# EAGLE design EiBotBoard-v23 (EAGLE 7.2.0)
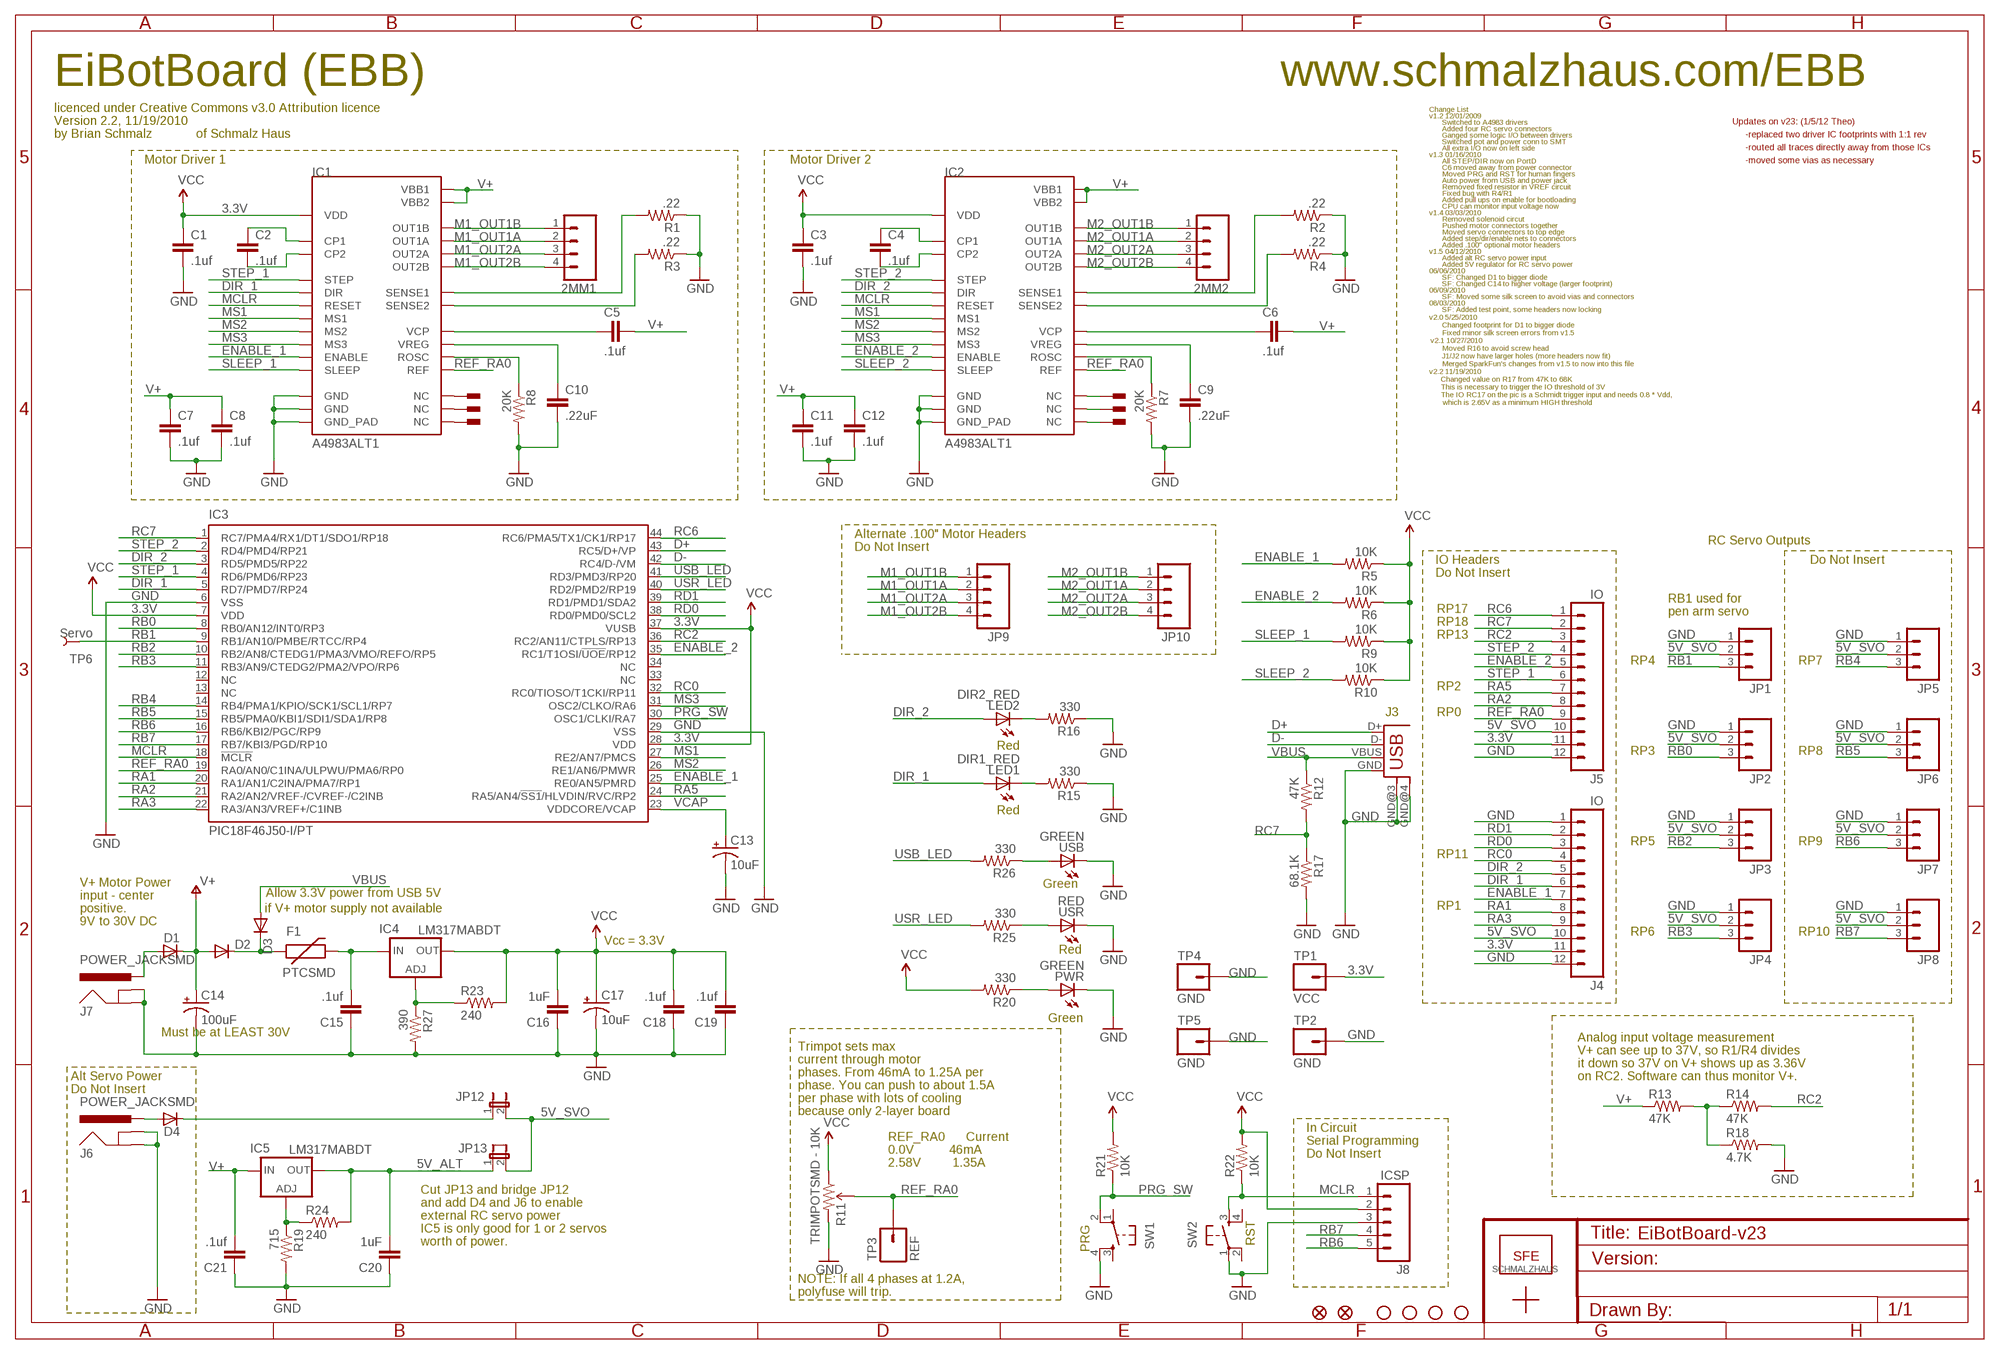
[diagram p0: schematic, sheet 1]

## Parts
2MM1  SCHMALZHAUS_M04  [SCHMALZHAUS_SCREWTERMINAL-3.5MM-4_LOCK]
2MM2  SCHMALZHAUS_M04  [SCHMALZHAUS_SCREWTERMINAL-3.5MM-4_LOCK]
C1  .1uf  CAP0603  [0603]
C2  .1uf  CAP0603  [0603]
C3  .1uf  CAP0603  [0603]
C4  .1uf  CAP0603  [0603]
C5  .1uf  CAP0603  [0603]
C6  .1uf  CAP0603  [0603]
C7  .1uf  CAP0603  [0603]
C8  .1uf  CAP0603  [0603]
C9  .22uF  CAP0603  [0603]
C10  .22uF  CAP0603  [0603]
C11  .1uf  CAP0603  [0603]
C12  .1uf  CAP0603  [0603]
C13  10uF  CAP_POL1206  [EIA3216]
C14  100uF  CAP_POLG  [PANASONIC_G]
C15  .1uf  CAP0603  [0603]
C16  1uF  CAP0603  [0603]
C17  10uF  CAP_POL1206  [EIA3216]
C18  .1uf  CAP0603  [0603]
C19  .1uf  CAP0603  [0603]
C20  1uF  CAP0603  [0603]
C21  .1uf  CAP0603  [0603]
D1  DIODE-DO214AC  [DO214AC]
D2  DIODESMA  [SMA-DIODE]
D3  DIODESMA  [SMA-DIODE]
D4  CGRM4001-G  [SOD-123_MINI-SMA]
F1  PTCSMD  [PTC-1206]
IC1  A4983ALT1  [QFN-28-5MM_ALT1]
IC2  A4983ALT1  [QFN-28-5MM_ALT1]
IC3  PIC18F46J50-I/PT  PIC18F4J50  [TQFP44]
IC4  LM317MABDT  [DPACK]
IC5  LM317MABDT  [DPACK]
J3  USBSMD  [USB-MINIB]
J4  IO  M12PTH  [1X12]
J5  IO  M12PTH  [1X12]
J6  POWER_JACKSMD  [POWER_JACK_SMD]
J7  POWER_JACKSMD  [POWER_JACK_SMD]
J8  ICSP  M05_WIDENOSILK  [1X05_NOSILK]
JP1  M03LOCK_NO_SILK  [1X03_LOCK_NO_SILK]
JP2  M031X03_NO_SILK  [1X03_NO_SILK]
JP3  M031X03_NO_SILK  [1X03_NO_SILK]
JP4  M031X03_NO_SILK  [1X03_NO_SILK]
JP5  M031X03_NO_SILK  [1X03_NO_SILK]
JP6  M031X03_NO_SILK  [1X03_NO_SILK]
JP7  M031X03_NO_SILK  [1X03_NO_SILK]
JP8  M031X03_NO_SILK  [1X03_NO_SILK]
JP9  M04POLAR  [MOLEX-1X4]
JP10  M04POLAR  [MOLEX-1X4]
JP11  LOGO-SFENEW  [SFE-NEW-WEBLOGO]
JP12  JUMPER-2SMD-NO  [SJ_2S-NO]
JP13  JUMPER-2SMD-NO  [SJ_2S-NO]
JP14  FIDUCIALUFIDUCIAL  [MICRO-FIDUCIAL]
JP15  FIDUCIALUFIDUCIAL  [MICRO-FIDUCIAL]
LED1  DIR1_RED  LED0603  [LED-0603]
LED2  DIR2_RED  LED0603  [LED-0603]
PWR  GREEN  LED0603  [LED-0603]
R1  .22  R-US_R0805  [R0805]
R2  .22  R-US_R0805  [R0805]
R3  .22  R-US_R0805  [R0805]
R4  .22  R-US_R0805  [R0805]
R5  10K  R-US_R0603  [R0603]
R6  10K  R-US_R0603  [R0603]
R7  20K  R-US_R0603  [R0603]
R8  20K  R-US_R0603  [R0603]
R9  10K  R-US_R0603  [R0603]
R10  10K  R-US_R0603  [R0603]
R11  TRIMPOTSMD - 10K  TRIMPOTSMD  [TRIMPOT-3MM]
R12  47K  R-US_R0603  [R0603]
R13  47K  R-US_R0603  [R0603]
R14  47K  R-US_R0603  [R0603]
R15  330  R-US_R0603  [R0603]
R16  330  R-US_R0603  [R0603]
R17  68.1K  R-US_R0603  [R0603]
R18  4.7K  R-US_R0603  [R0603]
R19  715  R-US_R0603  [R0603]
R20  330  R-US_R0603  [R0603]
R21  10K  R-US_R0603  [R0603]
R22  10K  R-US_R0603  [R0603]
R23  240  R-US_R0603  [R0603]
R24  240  R-US_R0603  [R0603]
R25  330  R-US_R0603  [R0603]
R26  330  R-US_R0603  [R0603]
R27  390  R-US_R0603  [R0603]
SW1  PRG  TAC_SWITCHSND  [TACTILE_SWITCH_SMD]
SW2  RST  TAC_SWITCHSND  [TACTILE_SWITCH_SMD]
TP1  VCC  M01_WIDENOSLIK  [1X01_NOSILK]
TP2  GND  M01_WIDENOSLIK  [1X01_NOSILK]
TP3  REF  M01PTH  [1X01]
TP4  GND  M01_WIDENOSLIK  [1X01_NOSILK]
TP5  GND  M01_WIDENOSLIK  [1X01_NOSILK]
TP6  Servo  TEST-POINT3X5  [PAD.03X.05]
U$1  SCHMALZHAUSSCHMALZHAUS_SMALL  [SCHMALZHAUS_SMALL]
U$2  STAND-OFF  [STAND-OFF]
U$3  STAND-OFF  [STAND-OFF]
U$4  STAND-OFF  [STAND-OFF]
U$5  STAND-OFF  [STAND-OFF]
U$6  PAD  [PAD-0.008]
U$7  PAD  [PAD-0.008]
U$8  PAD  [PAD-0.008]
U$9  PAD  [PAD-0.008]
U$10  PAD  [PAD-0.008]
U$11  PAD  [PAD-0.008]
USB  GREEN  LED0603  [LED-0603]
USR  RED  LED0603  [LED-0603]

## Nets
3.3V: C1.1 C3.1 C16.2 C17.A(+) C18.2 C19.2 IC1.P$15(VDD) IC2.P$15(VDD) IC3.7(VDD) IC3.28(VDD) IC3.37(VUSB) IC4.4(OUT) J4.11 J5.11 J8.2 R5.1 R6.1 R9.1 R10.1 R11.1(CCW) R20.2 R21.2 R22.2 R23.2 TP1.1 ; supply symbol labelled VCC
5V_ALT: C20.2 IC5.4(OUT) JP13.1 R24.2
5V_SVO: J4.10 J5.10 JP1.2 JP2.2 JP3.2 JP4.2 JP5.2 JP6.2 JP7.2 JP8.2 JP12.2 JP13.2
D+: IC3.43(RC5/D+/VP) J3.D+
D-: IC3.42(RC4/D-/VM) J3.D-
DIR_1: IC1.P$19(DIR) IC3.5(RD7/PMD7/RP24) J4.6 LED1.A
DIR_2: IC2.P$19(DIR) IC3.3(RD5/PMD5/RP22) J4.5 LED2.A
ENABLE_1: IC1.P$2(ENABLE) IC3.25(RE0/AN5/PMRD) J4.7 R5.2
ENABLE_2: IC2.P$2(ENABLE) IC3.35(RC1/T1OSI/!UOE!/RP12) J5.5 R6.2
GND: C1.2 C3.2 C7.2 C8.2 C9.2 C10.2 C11.2 C12.2 C13.C(-) C14.- C15.1 C16.1 C17.C(-) C18.1 C19.1 C20.1 C21.1 IC1.P$3(GND) IC1.P$18(GND) IC1.P$29(GND_PAD) IC2.P$3(GND) IC2.P$18(GND) IC2.P$29(GND_PAD) IC3.6(VSS) IC3.29(VSS) J3.GND J3.GND@3(GND) J3.GND@4(GND) J4.1 J4.12 J5.12 J6.GND(GNDBREAK) J6.P$4(GND) J7.GND(GNDBREAK) J7.P$4(GND) J8.3 JP1.1 JP2.1 JP3.1 JP4.1 JP5.1 JP6.1 JP7.1 JP8.1 PWR.C R1.1 R2.1 R3.1 R4.1 R7.2 R8.2 R11.3(CW) R15.1 R16.1 R17.2 R18.2 R19.2 R27.2 SW1.4 SW2.1 TP2.1 TP4.1 TP5.1 USB.C USR.C
M1_OUT1A: 2MM1.2 IC1.P$24(OUT1A) JP9.2
M1_OUT1B: 2MM1.1 IC1.P$21(OUT1B) JP9.1
M1_OUT2A: 2MM1.3 IC1.P$26(OUT2A) JP9.3
M1_OUT2B: 2MM1.4 IC1.P$1(OUT2B) JP9.4
M2_OUT1A: 2MM2.2 IC2.P$24(OUT1A) JP10.2
M2_OUT1B: 2MM2.1 IC2.P$21(OUT1B) JP10.1
M2_OUT2A: 2MM2.3 IC2.P$26(OUT2A) JP10.3
M2_OUT2B: 2MM2.4 IC2.P$1(OUT2B) JP10.4
MCLR: IC1.P$12(RESET) IC2.P$12(RESET) IC3.18(!MCLR!) J8.1 R22.1 SW2.3
MS1: IC1.P$9(MS1) IC2.P$9(MS1) IC3.27(RE2/AN7/PMCS)
MS2: IC1.P$10(MS2) IC2.P$10(MS2) IC3.26(RE1/AN6/PMWR)
MS3: IC1.P$11(MS3) IC2.P$11(MS3) IC3.31(OSC2/CLKO/RA6)
N$2: D2.C D3.C F1.1
N$3: C2.1 IC1.P$4(CP1)
N$4: R13.2 R14.1 R18.1
N$5: C2.2 IC1.P$5(CP2)
N$6: D1.A J7.VIN0(PWR)
N$7: D4.A J6.VIN0(PWR)
N$8: IC5.1(ADJ) R19.1 R24.1
N$9: IC4.1(ADJ) R23.1 R27.1
N$10: D4.C JP12.1
N$11: IC1.P$7(NC) U$9.P$1
N$12: IC1.P$20(NC) U$11.P$1
N$13: IC1.P$25(NC) U$10.P$1
N$14: IC2.P$7(NC) U$6.P$1
N$15: IC2.P$20(NC) U$7.P$1
N$16: C4.1 IC2.P$4(CP1)
N$17: C4.2 IC2.P$5(CP2)
N$18: IC2.P$25(NC) U$8.P$1
N$19: IC1.P$13(ROSC) R8.1
N$20: C10.1 IC1.P$8(VREG)
N$21: C5.1 IC1.P$6(VCP)
N$26: LED2.C R16.2
N$27: PWR.A R20.1
N$29: R26.1 USB.A
N$30: R25.1 USR.A
N$31: IC1.P$27(SENSE2) R3.2
N$32: IC1.P$23(SENSE1) R1.2
N$35: LED1.C R15.2
N$36: C15.2 F1.2 IC4.3(IN)
N$41: C6.1 IC2.P$6(VCP)
N$43: IC2.P$23(SENSE1) R2.2
N$44: IC2.P$27(SENSE2) R4.2
N$45: C9.1 IC2.P$8(VREG)
N$48: IC2.P$13(ROSC) R7.1
PRG_SW: IC3.30(OSC1/CLKI/RA7) R21.1 SW1.2
RA1: IC3.20(RA1/AN1/C2INA/PMA7/RP1) J4.8
RA2: IC3.21(RA2/AN2/VREF-/CVREF-/C2INB) J5.8
RA3: IC3.22(RA3/AN3/VREF+/C1INB) J4.9
RA5: IC3.24(RA5/AN4/!SS1!/HLVDIN/RVC/RP2) J5.7
RB0: IC3.8(RB0/AN12/INT0/RP3) JP2.3
RB1: IC3.9(RB1/AN10/PMBE/RTCC/RP4) JP1.3 TP6.P$1
RB2: IC3.10(RB2/AN8/CTEDG1/PMA3/VMO/REFO/RP5) JP3.3
RB3: IC3.11(RB3/AN9/CTEDG2/PMA2/VPO/RP6) JP4.3
RB4: IC3.14(RB4/PMA1/KPIO/SCK1/SCL1/RP7) JP5.3
RB5: IC3.15(RB5/PMA0/KBI1/SDI1/SDA1/RP8) JP6.3
RB6: IC3.16(RB6/KBI2/PGC/RP9) J8.5 JP7.3
RB7: IC3.17(RB7/KBI3/PGD/RP10) J8.4 JP8.3
RC0: IC3.32(RC0/TIOSO/T1CKI/RP11) J4.4
RC2: IC3.36(RC2/AN11/CTPLS/RP13) J5.3 R14.2
RC6: IC3.44(RC6/PMA5/TX1/CK1/RP17) J5.1
RC7: IC3.1(RC7/PMA4/RX1/DT1/SDO1/RP18) J5.2 R12.2 R17.1
RD0: IC3.38(RD0/PMD0/SCL2) J4.3
RD1: IC3.39(RD1/PMD1/SDA2) J4.2
REF_RA0: IC1.P$17(REF) IC2.P$17(REF) IC3.19(RA0/AN0/C1INA/ULPWU/PMA6/RP0) J5.9 R11.2(WIPER) TP3.1
SLEEP_1: IC1.P$14(SLEEP) R9.2
SLEEP_2: IC2.P$14(SLEEP) R10.2
STEP_1: IC1.P$16(STEP) IC3.4(RD6/PMD6/RP23) J5.6
STEP_2: IC2.P$16(STEP) IC3.2(RD4/PMD4/RP21) J5.4
USB_LED: IC3.41(RD3/PMD3/RP20) R26.2
USR_LED: IC3.40(RD2/PMD2/RP19) R25.2
V+: C5.2 C6.2 C7.1 C8.1 C11.1 C12.1 C14.+ C21.2 D1.C D2.A IC1.P$22(VBB1) IC1.P$28(VBB2) IC2.P$22(VBB1) IC2.P$28(VBB2) IC5.3(IN) R13.1
VBUS: D3.A J3.VBUS R12.1
VCAP: C13.A(+) IC3.23(VDDCORE/VCAP)
Unconnected: IC3.12(NC) IC3.13(NC) IC3.33(NC) IC3.34(NC) SW1.1 SW1.3 SW2.2 SW2.4

## Notes on the sheet
- EiBotBoard (EBB) | www.schmalzhaus.com/EBB
- licenced under Creative Commons v3.0 Attribution licence | Change List
- v1.2 12/01/2009
- Version 2.2, 11/19/2010 | Switched to A4983 drivers | Updates on v23: (1/5/12 Theo)
- Added four RC servo connectors
- by Brian Schmalz | of Schmalz Haus | Ganged some logic I/O between drivers | -replaced two driver IC footprints with 1:1 rev
- Switched pot and power conn to SMT
- All extra I/O now on left side | -routed all traces directly away from those ICs
- v1.3 01/16/2010
- Motor Driver 1 | Motor Driver 2 | All STEP/DIR now on PortD | -moved some vias as necessary
- C6 moved away from power connector
- Moved PRG and RST for human fingers
- Auto power from USB and power jack
- Removed fixed resistor in VREF circuit
- Fixed bug with R4/R1
- Added pull ups on enable for bootloading
- CPU can monitor input voltage now
- v1.4 03/03/2010
- Removed solenoid circut
- Pushed motor connectors together
- Moved servo connectors to top edge
- Added step/dir/enable nets to connectors
- Added .100" optional motor headers
- v1.5 04/12/2010
- Added alt RC servo power input
- Added 5V regulator for RC servo power
- 06/06/2010
- SF: Changed D1 to bigger diode
- SF: Changed C14 to higher voltage (larger footprint)
- 06/09/2010
- SF: Moved some silk screen to avoid vias and connectors
- 08/03/2010
- SF: Added test point, some headers now locking
- v2.0 5/25/2010
- Changed footprint for D1 to bigger diode
- Fixed minor silk screen errors from v1.5
- v2.1 10/27/2010
- Moved R16 to avoid screw head
- J1/J2 now have larger holes (more headers now fit)
- Merged SparkFun's changes from v1.5 to now into this file
- v2.2 11/19/2010
- Changed value on R17 from 47K to 68K
- This is necessary to trigger the IO threshold of 3V
- The IO RC17 on the pic is a Schmidt trigger input and needs 0.8 * Vdd,
- which is 2.65V as a minimum HIGH threshold
- Alternate .100" Motor Headers
- RC Servo Outputs
- Do Not Insert
- IO Headers | Do Not Insert
- Do Not Insert
- RB1 used for
- RP17 | pen arm servo
- RP18
- RP13
- RP4 | RP7
- RP2
- J3 | RP0
- Red
- RP3 | RP8
- Red
- RP5 | RP9
- RP11
- V+ Motor Power | Green
- input - center | Allow 3.3V power from USB 5V
- positive. | if V+ motor supply not available | RP1
- 9V to 30V DC
- RP6 | RP10
- Vcc = 3.3V | Red
- Green
- Must be at LEAST 30V
- Analog input voltage measurement
- Trimpot sets max
- V+ can see up to 37V, so R1/R4 divides
- current through motor
- it down so 37V on V+ shows up as 3.36V
- phases. From 46mA to 1.25A per
- Alt Servo Power | on RC2. Software can thus monitor V+.
- phase. You can push to about 1.5A
- Do Not Insert
- per phase with lots of cooling
- because only 2-layer board
- In Circuit
- REF_RA0      Current
- Serial Programming
- 0.0V          46mA
- Do Not Insert
- 2.58V         1.35A
- Cut JP13 and bridge JP12
- and add D4 and J6 to enable
- external RC servo power
- PRG
- IC5 is only good for 1 or 2 servos
- worth of power. | RST
- NOTE: If all 4 phases at 1.2A,
- polyfuse will trip.

## Library data of the parts
2MM1 2MM2 = EiBotBoard-v21:SCHMALZHAUS_M04: Header 4 Standard 4-pin 0.1" header. Use with straight break away headers (SKU : PRT-00116), right angle break away headers (PRT-00553), swiss pins (PRT-00743), machine pins (PRT-00117), and female headers (PRT-00115). Molex polarized connector foot print use with SKU : PRT-08231 with associated crimp pins and housings.
C1-C12 C15 C16 C18-C21 = SparkFun-2-11-09:CAP: Capacitor Standard 0603 ceramic capacitor, and 0.1" leaded capacitor.
C13 C17 = SparkFun-2-11-09:CAP_POL: Capacitor Polarized These are standard SMD and PTH capacitors. Normally 10uF, 47uF, and 100uF in electrolytic and tantalum varieties. Always verify the external diameter of the through hole cap, it varies with capacity, voltage, and manufacturer. The EIA devices should be standard.
C14 = SparkFun:CAP_POL: Capacitor Polarized These are standard SMD and PTH capacitors. Normally 10uF, 47uF, and 100uF in electrolytic and tantalum varieties. Always verify the external diameter of the through hole cap, it varies with capacity, voltage, and manufacturer. The EIA devices should be standard.
D1 = diode:DIODE-: DIODE
D2 D3 = SparkFun:DIODE: Diode These are standard reverse protection diodes and small signal diodes. SMA package can handle up to about 1A. SOD-323 can handle about 200mA. What the SOD-323 package when ordering, there are some mfgs out there that are 5-pin packages.
D4 = diode:CGRM400*-G: Molded plasitc,JEDEC SOD-123/Mini SMA Source: Comchip CGRM4001-G.pdf
F1 = SchmalzHaus:PTC: Resettable Fuse PTC Resettable Fuse. Spark Fun Electronics SKU : COM-08357
IC1 IC2 = Testing:A4983: DMOS Microstepping Driver with Translator
IC3 = SchmalzHaus:PIC18F4*J50
IC4 IC5 = v-reg:LM317?*: 500 mA Adjustable Output Positive Voltage Regulator Source: http://www.onsemi.co.jp .. LM317M-D.PDF
J3 = SchmalzHaus:USB: USB Connectors USB-B-PTH is fully proven SKU : PRT-00139 USB-miniB is fully proven SKU : PRT-00587 USB-A-PCB is untested. USB-A-H is throughly reviewed, but untested. Spark Fun Electronics SKU : PRT-00437 USB-B-SMT is throughly reviewed, but untested. Needs silkscreen touching up. USB-A-S has not been used/tested USB-MB-H has not been used/tested
J4 J5 = SparkFun-12-01-09:M12: Header 12 Standard 12-pin 0.1" header. Use with straight break away headers (SKU : PRT-00116), right angle break away headers (PRT-00553), swiss pins (PRT-00743), machine pins (PRT-00117), and female headers (PRT-00115).
J6 J7 = SparkFun11_03_09:POWER_JACK: Power Jack This is the standard 5.5mm barrel jack for power. The PTH is the most common, proven, reliable, footprint. All others are experimental. The Slot footprint only works if the mill layer is transmitted to the PCB fab house so be warned. Spark Fun Electronics SKU : PRT-00119. Mating wall wart : TOL-00298 (and others)
J8 = SchmalzHaus:M05_WIDE: Header 5 Standard 5-pin 0.1" header. Use with straight break away headers (SKU : PRT-00116), right angle break away headers (PRT-00553), swiss pins (PRT-00743), machine pins (PRT-00117), and female headers (PRT-00115). Molex polarized connector foot print use with SKU : PRT-08230 with associated crimp pins and housings.
JP1 = SparkFun:M03: Header 3 Standard 3-pin 0.1" header. Use with straight break away headers (SKU : PRT-00116), right angle break away headers (PRT-00553), swiss pins (PRT-00743), machine pins (PRT-00117), and female headers (PRT-00115). Molex polarized connector foot print use with SKU : PRT-08232 with associated crimp pins and housings.
JP2-JP8 = SparkFun-12-01-09:M03: Header 3 Standard 3-pin 0.1" header. Use with straight break away headers (SKU : PRT-00116), right angle break away headers (PRT-00553), swiss pins (PRT-00743), machine pins (PRT-00117), and female headers (PRT-00115). Molex polarized connector foot print use with SKU : PRT-08232 with associated crimp pins and housings.
JP9 JP10 = SparkFun-12-01-09:M04: Header 4 Standard 4-pin 0.1" header. Use with straight break away headers (SKU : PRT-00116), right angle break away headers (PRT-00553), swiss pins (PRT-00743), machine pins (PRT-00117), and female headers (PRT-00115). Molex polarized connector foot print use with SKU : PRT-08231 with associated crimp pins and housings.
JP11 = SparkFun-12-01-09:LOGO-SFE: Spark Fun Electronics PCB Logo This is the standard Spark Fun Electronics PCB logo.
JP12 JP13 = SparkFun-12-01-09:JUMPER-2: Jumper Basic 0.1" spaced jumper. Use with breakaway headers.
JP14 JP15 = SparkFun:FIDUCIAL: Fiducial Alignment Points Various fiducial points for machine vision alignment.
LED1 LED2 PWR USB USR = SparkFun-2-11-09:LED: LEDs Standard schematic elements and footprints for 5mm, 3mm, 1206, and 0603 sized LEDs. 5mm - Spark Fun Electronics SKU : COM-00529 (and others)
R1-R10 R12-R27 = rcl:R-US_: RESISTOR, American symbol
R11 = SparkFun11_03_09:TRIMPOT
SW1 SW2 = SparkFunEagle-6-6-07:TAC_SWITCH: Momentary Switch Button commonly used for reset or general input. Spark Fun Electronics SKU : COM-00097
TP1 TP2 TP4 TP5 = SchmalzHaus:M01_WIDE: Header 1 Standard 1-pin 0.1" header. Use with straight break away headers (SKU : PRT-00116), right angle break away headers (PRT-00553), swiss pins (PRT-00743), machine pins (PRT-00117), and female headers (PRT-00115).
TP3 = SchmalzHaus:M01: Header 1 Standard 1-pin 0.1" header. Use with straight break away headers (SKU : PRT-00116), right angle break away headers (PRT-00553), swiss pins (PRT-00743), machine pins (PRT-00117), and female headers (PRT-00115).
TP6 = SparkFun:TEST-POINT
U$1 = SchmalzHaus:SCHMALZHAUS
U$2-U$5 = SparkFun01082009:STAND-OFF: Stand Off This is the mechanical footprint for a #4 phillips button head screw. Use the keepout ring to avoid running the screw head into surrounding components. SKU : PRT-00447
U$6-U$11 = Testing:PAD

## Board
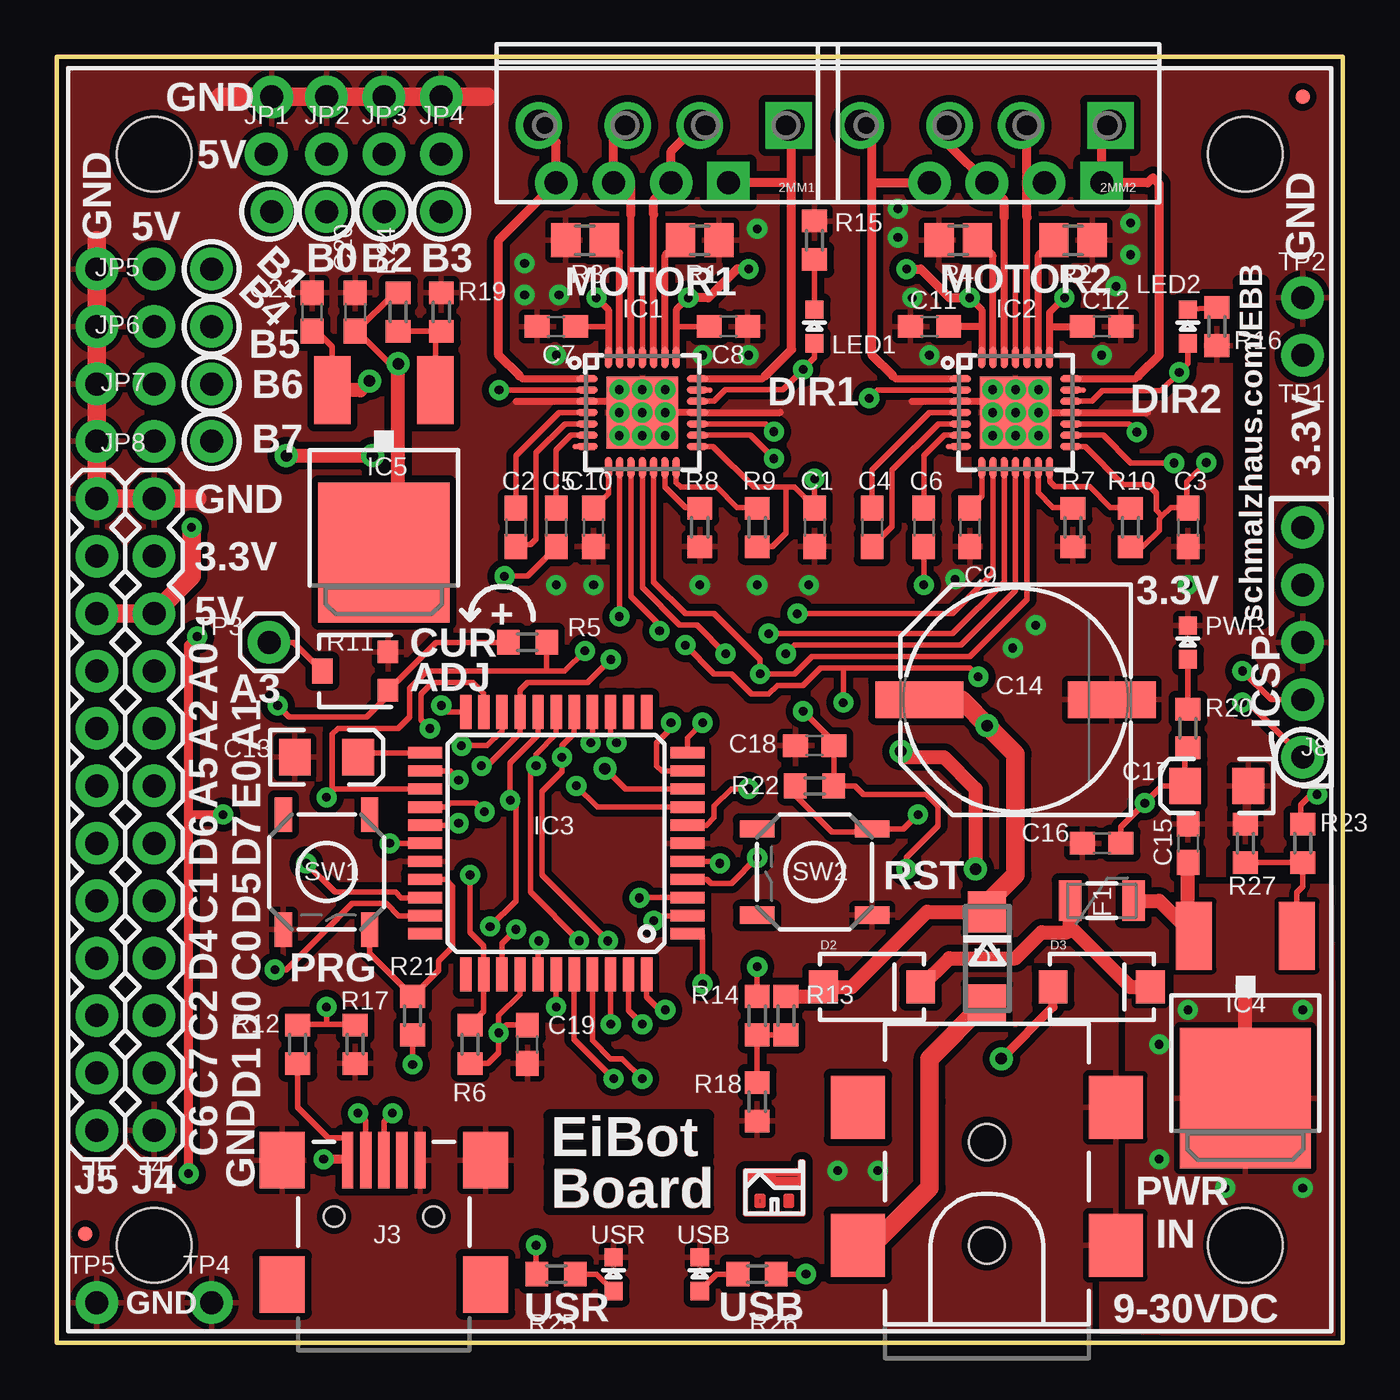
[diagram p1: board, top side]
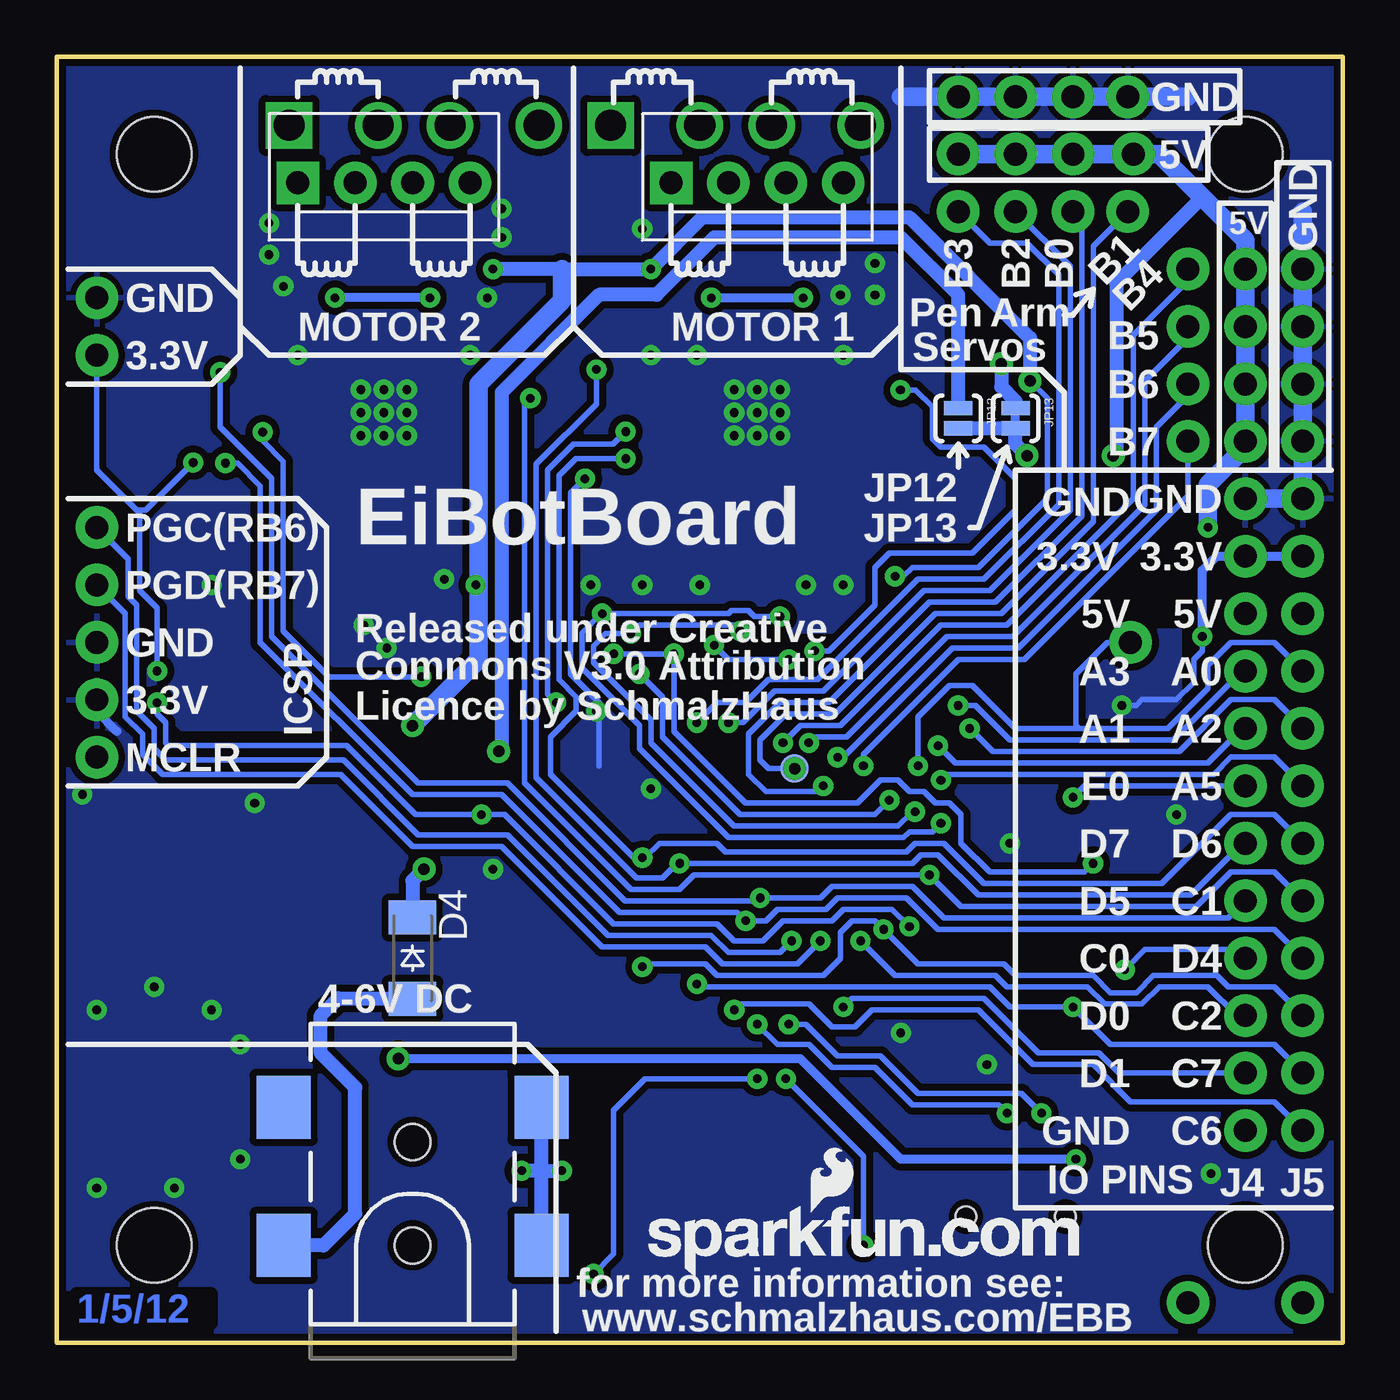
[diagram p2: board, bottom side, seen from below]

Size 56.9 x 56.9 mm. Coordinates in mm from the lower left corner, seen from the top.
Outline: 0,56.9 0,0 56.9,0 56.9,56.9 0,56.9
Copper layers (1*16): Top 0.035mm / dielectric 1.5mm / Bottom 0.035mm
Design rules "default": minimum track width 8mil, minimum drill 20mil, track to track 8mil, track to pad 8mil, pad to pad 8mil, via to via 8mil, smd to smd 8mil, copper to edge 8mil, drill to drill 8mil, minimum pad ring 12mil, minimum via ring 10mil, stop-mask expansion 4mil, vias tented up to drill 20mil, thermal gap 10mil

### Footprints (pad centres in the part's own frame; a part is rotated, then mirrored left to right if it is on the bottom)
SCHMALZHAUS_SCREWTERMINAL-3.5MM-4_LOCK = drill 1.372 square: 1 -0.127,0 | drill 1.372: 2 3.81,0; 3 6.985,0; 4 10.922,0
0603 = smd 1.1 x 1: 1 -0.85,0; 2 0.85,0
EIA3216 = smd 1.4 x 1.6: A 1.4,0; C -1.4,0
PANASONIC_G = smd 3.9 x 1.6: + 4.25,0; - -4.25,0
DO214AC = smd 1.8 x 1.7: A 2.05,0; C -2.05,0
SMA-DIODE = smd 1.27 x 1.47: A -2.15,0; C 2.15,0
SOD-123_MINI-SMA = smd 1.5 x 2.1: A 1.8,0; C -1.8,0
PTC-1206 = smd 1 x 1.8: 1 -1.4,0; 2 1.4,0
QFN-28-5MM_ALT1 = smd 0.94 x 0.3: P$1 -2.44,1.5; P$2 -2.44,1; P$3 -2.44,0.5; P$4 -2.44,0; P$5 -2.44,-0.5; P$6 -2.44,-1; P$7 -2.44,-1.5; P$15 2.44,-1.5; P$16 2.44,-1; P$17 2.44,-0.5; P$18 2.44,0; P$19 2.44,0.5; P$20 2.44,1; P$21 2.44,1.5 | smd 0.3 x 0.94: P$8 -1.5,-2.44; P$9 -1,-2.44; P$10 -0.5,-2.44; P$11 0,-2.44; P$12 0.5,-2.44; P$13 1,-2.44; P$14 1.5,-2.44; P$22 1.5,2.44; P$23 1,2.44; P$24 0.5,2.44; P$25 0,2.44; P$26 -0.5,2.44; P$27 -1,2.44; P$28 -1.5,2.44 | smd 3.175 x 3.175: P$29 0,0
TQFP44 = smd 1.5 x 0.5: 1 -5.8,4; 2 -5.8,3.2; 3 -5.8,2.4; 4 -5.8,1.6; 5 -5.8,0.8; 6 -5.8,0; 7 -5.8,-0.8; 8 -5.8,-1.6; 9 -5.8,-2.4; 10 -5.8,-3.2; 11 -5.8,-4; 23 5.8,-4; 24 5.8,-3.2; 25 5.8,-2.4; 26 5.8,-1.6; 27 5.8,-0.8; 28 5.8,0; 29 5.8,0.8; 30 5.8,1.6; 31 5.8,2.4; 32 5.8,3.2; 33 5.8,4 | smd 0.5 x 1.5: 12 -4,-5.8; 13 -3.2,-5.8; 14 -2.4,-5.8; 15 -1.6,-5.8; 16 -0.8,-5.8; 17 0,-5.8; 18 0.8,-5.8; 19 1.6,-5.8; 20 2.4,-5.8; 21 3.2,-5.8; 22 4,-5.8; 34 4,5.8; 35 3.2,5.8; 36 2.4,5.8; 37 1.6,5.8; 38 0.8,5.8; 39 0,5.8; 40 -0.8,5.8; 41 -1.6,5.8; 42 -2.4,5.8; 43 -3.2,5.8; 44 -4,5.8
DPACK = smd 1.6 x 3: 1 -2.28,-4.8; 3 2.28,-4.8 | smd 5.8 x 6.2: 4 0,2.38
USB-MINIB = smd 2.5 x 0.5: D+ 2.5,0; D- 2.5,0.8; GND 2.5,-1.6; ID 2.5,-0.8; VBUS 2.5,1.6 | smd 2.5 x 2: GND@1 -3,-4.5; GND@2 -3,4.5; GND@3 2.5,4.5; GND@4 2.5,-4.5 | hole 0.9: 0,2.2; 0,-2.2
1X12 = drill 1.016 pad 1.88: 1 0,0; 2 2.54,0; 3 5.08,0; 4 7.62,0; 5 10.16,0; 6 12.7,0; 7 15.24,0; 8 17.78,0; 9 20.32,0; 10 22.86,0; 11 25.4,0; 12 27.94,0
POWER_JACK_SMD = smd 2.8 x 2.4: GND 0,-5.7; P$4 6.1,-5.7; VIN0 0,5.7; VIN1 6.1,5.7 | hole 1.6: 0,0; 4.572,0
1X05_NOSILK = drill 1.016 pad 1.88: 1 0,0; 2 2.54,0; 3 5.08,0; 4 7.62,0; 5 10.16,0
1X03_LOCK_NO_SILK = drill 1.016 pad 1.88: 1 0,0.127; 2 2.54,-0.127; 3 5.08,0.127
1X03_NO_SILK = drill 1.016 pad 1.88: 1 0,0; 2 2.54,0; 3 5.08,0
MOLEX-1X4 = drill 1.016 pad 1.88 square: 1 0,0 | drill 1.016 pad 1.88: 2 2.54,0; 3 5.08,0; 4 7.62,0
SJ_2S-NO = smd 0.635 x 1.27: 1 -0.45,0; 2 0.45,0
MICRO-FIDUCIAL = smd 0.635 x 0.635: 1 0,0
LED-0603 = smd 0.8 x 0.8: A 0,-0.75; C 0,0.75
R0805 = smd 1.3 x 1.5: 1 -0.85,0; 2 0.85,0
R0603 = smd 1 x 1.1: 1 -0.85,0; 2 0.85,0
TRIMPOT-3MM = smd 1 x 0.9: 1 -0.85,-1.45; 3 0.85,-1.45 | smd 1.1 x 0.9: 2 0,1.45
TACTILE_SWITCH_SMD = smd 1.524 x 0.762: 1 -2.54,1.905; 2 2.54,1.905; 3 -2.54,-1.905; 4 2.54,-1.905
1X01_NOSILK = drill 1.016 pad 1.88: 1 0,0
1X01 = drill 1.016 pad 1.88: 1 0,0
PAD.03X.05 = smd 1.27 x 1.27: P$1 0,0
STAND-OFF = hole 3.302: 0,0
PAD-0.008 = smd 0.203 x 0.203: P$1 0,0

### Placement (x,y rotation side)
2MM1  32.26,53.85 180 top
2MM2  46.48,53.85 180 top
C1  33.53,36.07 270 top
C2  20.32,36.07 270 top
C3  50.04,36.07 270 top
C4  36.07,36.07 270 top
C5  22.1,36.07 270 top
C6  38.35,36.07 270 top
C7  22.1,44.96 180 top
C8  29.72,44.96 0 top
C9  40.39,36.07 270 top
C10  23.75,36.07 270 top
C11  38.61,44.96 180 top
C12  46.23,44.96 0 top
C13  11.94,25.91 0 top
C14  42.42,28.45 180 top
C15  50.04,22.1 270 top
C16  46.23,22.1 0 top
C17  51.31,24.64 180 top
C18  33.53,26.42 0 top
C19  20.83,13.21 90 top
C20  13.21,45.59 270 top
C21  11.3,45.59 270 top
D1  41.15,17.02 270 top
D2  36.07,15.75 0 top
D3  46.23,15.75 0 top
D4  41.15,17.02 270 bottom
F1  46.23,19.56 0 top
IC1  25.91,41.15 0 top
IC2  42.42,41.15 0 top
IC3  22.1,22.1 180 top
IC4  52.58,13.21 180 top
IC5  14.48,37.34 180 top
J3  14.48,5.59 90 top
J4  4.32,9.4 90 top
J5  1.78,9.4 90 top
J6  41.15,4.32 90 bottom
J7  41.15,4.32 90 top
J8  55.12,25.91 90 top
JP1  9.4,55.12 270 top
JP2  11.94,55.12 270 top
JP3  14.48,55.12 270 top
JP4  17.02,55.12 270 top
JP5  1.78,47.5 0 top
JP6  1.78,44.96 0 top
JP7  1.78,42.42 0 top
JP8  1.78,39.88 0 top
JP9  29.72,51.31 0 bottom
JP10  46.23,51.31 0 bottom
JP11  30.73,2.92 0 bottom
JP12  17.02,40.89 270 bottom
JP13  14.48,40.89 270 bottom
JP14  1.27,4.83 0 top
JP15  55.12,55.12 0 top
LED1  33.53,44.96 0 top
LED2  50.04,44.96 0 top
PWR  50.04,30.99 0 top
R1  28.45,48.77 180 top
R2  44.96,48.77 180 top
R3  23.37,48.77 0 top
R4  39.88,48.77 0 top
R5  20.83,30.99 0 top
R6  18.29,13.21 90 top
R7  44.96,36.07 270 top
R8  28.45,36.07 270 top
R9  30.99,36.07 90 top
R10  47.5,36.07 90 top
R11  13.21,29.72 90 top
R12  10.67,13.21 90 top
R13  32.26,14.48 270 top
R14  30.99,14.48 90 top
R15  33.53,48.77 270 top
R16  51.31,44.96 90 top
R17  13.21,13.21 270 top
R18  30.99,10.67 270 top
R19  17.02,45.59 90 top
R20  50.04,27.18 270 top
R21  15.75,14.48 270 top
R22  33.53,24.64 0 top
R23  55.12,22.1 90 top
R24  15.11,45.59 90 top
R25  22.1,3.05 180 top
R26  30.99,3.05 0 top
R27  52.58,22.1 90 top
SW1  11.94,20.83 270 top
SW2  33.53,20.83 180 top
TP1  55.12,43.69 0 top
TP2  55.12,46.23 0 top
TP3  9.4,30.99 0 top
TP4  6.86,1.78 0 top
TP5  1.78,1.78 0 top
TP6  24.26,25.4 0 bottom
U$1  31.75,5.71 0 top
U$2  52.58,4.32 0 top
U$3  4.32,4.32 0 top
U$4  52.58,52.58 0 top
U$5  4.32,52.58 0 top
U$6  39.45,39.65 0 top
U$7  45.42,42.14 0 top
U$8  42.42,47.5 0 top
U$9  22.94,39.65 0 top
U$10  25.91,47.5 0 top
U$11  28.91,42.14 0 top
USB  28.45,3.05 0 top
USR  24.64,3.05 0 top

### Tracks (layer width: path | path; a pad name or v marks a point on that pad's centre or on a via)
3.3V  (via drill 0.38)
  Top 0.254: 32.26,37.85 32.64,37.85 33.53,36.96 C1.1 v33.53,38.23 | IC3.37 20.5,15.42 19.56,14.48 v19.56,13.72 | R10.1 48.05,35.22 48.77,35.94 48.77,36.45 48.9,36.58 | 48.9,36.58 49.28,36.96 50,36.96 50,38.09 v50.85,38.94 | R9.1 31.66,35.22 32.26,35.81 32.26,37.85 | R21.2 v15.75,12.32 15.79,12.36 | v19.56,13.72 19.9,14.06 C19.2 | R6.1 19.09,12.36 19.56,12.83 v19.56,13.72 | IC3.7 28.74,22.9 29.08,23.24 29.08,23.75 29.84,24.51 v30.61,24.51 | v14.73,22.1 IC3.28 | R23.2 55.03,22.95 55.03,23.79 55.5,24.26 v55.75,24.26 | v52.45,29.72 53.72,28.45 J8.2 | C16.2 47.08,22.82 v48.13,23.88 48.9,24.64 C17.A 49.91,26.2 R20.2 | 48.9,36.58 48.64,36.83 48.64,37.59 48.26,37.97 47.17,37.97 45.5,39.64 44.82,39.64 IC2.P$15 | R5.1 16.78,30.99 R11.1 14.66,28.63 13.72,27.69 10.29,27.69 v9.78,28.19 | v37.59,20.95 37.59,21.46 38.99,22.86 38.99,23.75 38.48,24.26 35.69,24.26 35.31,24.64 R22.2 C18.2 34.38,26.58 v33.02,27.94 | IC1.P$15 29.03,39.65 30.84,37.85 32.26,37.85
  Top 0.305: 50,36.96 C3.1
  Top 0.406: v5.84,7.49 5.84,23.37 | 5.84,23.37 v7.37,23.37 | 5.84,23.37 5.84,30.86 v6.22,31.24
  Top 0.61: IC4.4 v52.58,15.75
  Bottom 0.254: v33.53,38.23 34.16,37.59 34.16,29.59 32.89,28.32 32.89,25.53 | v52.45,29.72 52.45,32.51 53.21,33.27 53.21,36.7 53.34,36.83 | 53.34,36.83 55.12,38.61 TP1.1 | 6.22,34.16 6.22,32.51 | v6.22,31.24 6.22,30.61 6.6,30.23 6.6,29.21 7.37,28.45 8.89,28.45 9.14,28.19 v9.78,28.19 | 53.34,36.83 52.96,36.83 v50.85,38.94
  Bottom 0.406: J5.11 J4.11 5.59,34.8 6.22,34.16 v6.22,31.24 | J8.2 55.12,27.94 54.23,27.05
  other vias: 48.77,13.21 48.77,8.13 55.12,6.86 51.69,6.86 55.12,14.73 50.04,14.73
  pour Bottom (isolate 0.305, rank 3): 0.25,28.45 0.25,0.25 56.64,0.25 56.64,29.72 52.58,29.72 52.58,25.91 39.88,25.91 33.53,31.5 7.24,31.5 7.24,28.45
  pour Top: 47.37,15.11 47.37,4.95 46.23,3.68 46.23,0.51 56.64,0.25 56.39,20.19 49.53,20.19 49.53,15.11
5V_ALT  (via drill 0.51)
  Top 0.254: 15.04,46.44 R24.2 15.11,46.48 14.99,46.48 13.25,44.74 C20.2 13.42,44.74 13.42,44.62 14.73,43.31 v15.11,43.31
  Top 0.61: IC5.4 14.48,37.21 15.11,37.85 v15.11,43.31
  Bottom 0.61: v15.11,43.31 15.11,42.29 14.48,41.66 JP13.1
5V_SVO  (via drill 0.38, 0.51)
  Top 0.61: v10.16,39.24 v13.97,39.24
  Top 0.813: v5.97,36.07 5.97,33.91 J4.10 J5.10
  Bottom 0.406: 4.32,39.62 JP8.2 | 6.86,51.31 6.86,51.18 6.22,50.55 6.35,50.55
  Bottom 0.61: JP12.2 JP13.2 14.48,39.75 v13.97,39.24 | 6.35,50.55 10.03,46.86 10.03,39.37 v10.16,39.24
  Bottom 0.813: JP4.2 JP3.2 JP2.2 JP1.2 8.13,52.58 6.86,51.31 4.32,48.77 JP5.2 JP6.2 JP7.2 JP8.2 | 4.32,39.62 5.97,37.97 v5.97,36.07
D+  (via drill 0.38)
  Top 0.254: IC3.43 25.3,14.71 v25.91,14.1 | J3.D+ 14.48,9.78 v14.86,10.16
  Bottom 0.254: v25.91,14.1 25.02,13.21 23.62,13.21 22.61,12.19 20.7,12.19 19.05,10.54 15.24,10.54 v14.86,10.16
D-  (via drill 0.38)
  Top 0.254: 13.72,8.05 J3.D- 13.68,9.82 v13.34,10.16 | IC3.42 24.5,14.11 v24.51,14.1
  Bottom 0.254: v24.51,14.1 23.75,14.1 22.35,12.7 20.45,12.7 18.8,11.05 14.22,11.05 v13.34,10.16
DIR_1  (via drill 0.38)
  Top 0.254: LED1.A 33.53,43.57 v33.02,43.07 v33.02,43.05 32.13,42.16 29.59,42.16 29.07,41.65 IC1.P$19 | IC3.5 29.3,21.3 29.3,21.25 v29.34,21.21
  Bottom 0.254: J4.6 4.45,22.1 6.73,19.81 16.13,19.81 17.91,21.59 18.67,21.59 19.05,21.21 v29.34,21.21 29.46,21.21 30.1,20.57 31.24,20.57 35.69,25.02 35.69,38.86 33.02,41.53 v33.02,43.05
DIR_2  (via drill 0.38)
  Top 0.254: IC3.3 25.79,19.7 v25.78,19.68 | LED2.A 50.03,44.2 50.03,43.31 50.04,43.31 v49.66,42.93 48.84,42.11 46.25,42.11 45.79,41.65 IC2.P$19
  Bottom 0.254: v49.66,42.93 49.66,40.51 47.37,38.23 47.37,31.24 40.89,24.77 36.96,24.77 31.75,19.56 25.91,19.56 v25.78,19.68 23.11,19.68 22.61,20.19 19.05,20.19 17.65,18.8 5.08,18.8 J4.5
ENABLE_1  (via drill 0.38)
  Top 0.254: v19.57,42.15 IC1.P$2 | IC3.25 15.25,24.5 15.24,24.51 12.32,24.51 12.19,24.38 | v11.94,24.13 12.19,24.38 | 12.19,24.38 12.19,26.92 12.45,27.18 15.11,27.18 15.62,27.69 15.62,28.96 16.38,29.72 21.72,29.72 | 21.72,29.72 22.48,29.72 v23.37,30.61 | R5.2 21.68,29.76 21.72,29.72
  Bottom 0.254: J4.7 11.43,24.64 v11.94,24.13 | v23.37,30.61 22.73,30.61 20.7,32.64 20.7,34.29 20.07,34.93 16.38,34.93 14.48,36.83 14.48,38.23 15.88,39.62 17.78,39.62 18.16,40.01 18.16,41.4 18.91,42.15 v19.57,42.15
ENABLE_2  (via drill 0.38)
  Top 0.254: R6.2 18.9,14.67 IC3.35 18.9,17.55 18.29,18.16 v18.29,20.7 | IC2.P$2 36.31,42.15 v35.94,41.78
  Bottom 0.254: J5.5 3.05,20.83 4.95,20.83 6.48,19.3 16.89,19.3 v18.29,20.7 28.7,20.7 29.34,20.07 31.5,20.07 36.2,24.77 36.2,41.53 v35.94,41.78
GND  (via drill 0.38)
  Top 0.254: J4.12 4.45,37.34 | 24.88,41.65 24.89,41.65 v24.89,41.15 | 41.65,41.65 41.4,41.65 v41.4,41.15
  Top 0.305: 20.33,41.65 IC1.P$3 24.76,41.65 | 24.76,41.65 24.77,41.66 | v26.92,41.15 IC1.P$18 32,41.15 | 41.66,41.66 41.65,41.65 IC2.P$3 37.85,41.65 37.85,41.66 | IC2.P$29 IC2.P$18 48.26,41.15 | 24.76,41.65 24.88,41.65
  Top 0.813: 1.78,48.77 JP8.1 J5.12 J4.12 6.22,37.34 | 7.24,55.12 19.05,55.12
  Bottom 0.254: 36.34,7.61 v36.32,7.62 | 34.56,7.61 v34.54,7.62
  Bottom 0.61: J6.GND 35.45,7.61 | 35.45,7.61 J6.P$4 | 35.45,7.61 36.34,7.61 | 35.45,7.61 34.56,7.61
  Bottom 0.813: 1.78,50.04 JP8.1 J5.12 J4.12 | 6.86,55.12 19.56,55.12
  other vias: 20.7,46.36 22.1,43.69 28.57,43.69 30.61,43.69 30.99,49.28 20.7,47.75 22.22,46.36 26.92,42.16 24.89,42.16 24.89,40.13 26.92,40.13 28.45,33.53 30.99,33.53 33.27,33.53 23.75,33.53 41.4,42.16 43.43,42.16 43.43,40.13 41.4,40.13 37.85,46.23 38.61,43.69 46.23,43.69 47.5,49.53 47.5,48.13 37.21,48.9 37.21,50.16 39.75,33.78 42.29,30.73 50.04,33.53 43.31,31.75 22.1,33.53 46.86,46.74 42.42,42.16 43.43,41.15 42.42,40.13 42.42,41.15 25.91,41.15 25.91,42.16 25.91,40.13
  pour Top (isolate 0.305, rank 3): 0.25,56.64 0.25,0.25 56.64,0.25 56.64,56.64
  pour Bottom (isolate 0.305, rank 2): 0.25,28.45 0.25,56.64 56.64,56.64 56.64,29.72 52.58,29.72 52.58,28.45 51.31,27.18 33.53,27.18 33.53,31.5 7.24,31.5 7.24,28.45
M1_OUT1A
  Top 0.305: IC1.P$24 26.41,49.9
  Top 0.406: 26.41,49.9 26.41,50.54 JP9.2 27.18,52.71 28.45,53.98 2MM1.2
M1_OUT1B
  Top 0.254: 31.22,42.65 31.24,42.67
  Top 0.305: 31.24,42.67 31.34,42.78 | IC1.P$21 31.22,42.65
  Top 0.406: 31.34,42.78 32.51,43.94 32.51,51.31 | 32.51,51.31 JP9.1 | 2MM1.1 32.26,53.85 32.51,53.59 32.51,51.31
M1_OUT2A
  Top 0.305: IC1.P$26 25.41,49.9
  Top 0.406: 25.41,49.9 25.41,51.31 JP9.3 24.64,53.21 2MM1.3
M1_OUT2B
  Top 0.305: IC1.P$1 20.6,42.65 20.47,42.78
  Top 0.406: 20.47,42.78 19.56,43.69 19.56,48.77 JP9.4 22.1,53.09 2MM1.4
M2_OUT1A
  Top 0.305: IC2.P$24 42.92,49.78
  Top 0.406: 42.92,49.78 42.92,51.31 | 42.92,51.31 JP10.2 | 2MM2.2 42.8,53.85 42.92,53.73 42.92,51.31
M2_OUT1B
  Top 0.254: 47.73,42.65 47.75,42.67
  Top 0.305: 47.75,42.67 47.86,42.78 | IC2.P$21 47.73,42.65
  Top 0.406: 47.86,42.78 48.77,43.69 48.77,51.26 48.49,51.54 48.26,51.31 JP10.1 46.23,53.47 2MM2.1
M2_OUT2A
  Top 0.305: IC2.P$26 41.92,49.78
  Top 0.406: 41.92,49.78 41.92,50.54 JP10.3 39.5,52.96 2MM2.3
M2_OUT2B
  Top 0.305: IC2.P$1 37.11,42.65 36.98,42.78
  Top 0.406: 36.98,42.78 36.07,43.69 36.07,51.31 | 36.07,51.31 JP10.4 | 36.07,51.31 36.07,53.34 2MM2.4
MCLR  (via drill 0.38)
  Top 0.254: IC1.P$12 26.41,33.65 26.42,33.64 26.43,33.64 27.81,32.26 29.08,32.26 31.11,30.23 v31.11,29.59 32.64,29.59 33.4,30.35 40.39,30.35 42.92,32.89 IC2.P$12 | v19.18,18.41 20.32,19.56 20.32,23.75 v20.07,24 20.07,25.65 21.3,26.89 IC3.18 | v52.45,28.32 52.71,28.32 J8.1 | R22.1 32.68,24.22 34.29,22.61 35.94,22.61 SW2.3 37.47,22.73 v38.1,23.37
  Bottom 0.254: v52.45,28.32 52.45,27.81 52.07,27.43 52.07,26.54 51.94,26.42 44.07,26.42 41.02,23.37 v38.1,23.37 37.08,23.37 32.26,18.54 27.69,18.54 26.92,17.78 25.65,17.78 24.77,18.67 22.61,18.67 22.1,19.18 19.94,19.18 v19.18,18.41 | v31.11,29.59 30.1,28.57 30.1,26.8 26.67,23.37 20.7,23.37 v20.07,24
MS1  (via drill 0.38)
  Top 0.254: IC1.P$9 24.91,33.04 24.89,33.02 v24.89,32.13 | IC2.P$9 41.42,34.05 39.62,32.26 32.89,32.26 v32.77,32.26 | IC3.27 17.31,22.9 17.4,22.99 v17.78,22.99
  Bottom 0.254: v24.89,32.13 26.04,32.13 26.29,32.38 27.05,32.38 27.18,32.26 v32.77,32.26 32.8,32.26 33.66,31.41 33.66,29.84 31.11,27.3 31.11,26.29 27.18,22.35 19.43,22.35 19.18,22.61 18.16,22.61 v17.78,22.99
MS2  (via drill 0.38)
  Top 0.254: IC1.P$10 25.41,33.03 25.4,33.02 26.67,31.75 v26.67,31.5 | v31.5,31.37 32.64,31.37 32.77,31.37 32.89,31.37 39.62,31.37 41.92,33.66 IC2.P$10 | IC3.26 17.22,23.7 17.4,23.88 18.54,23.88 v18.92,23.49
  Bottom 0.254: v18.92,23.49 19.05,23.49 19.68,22.86 26.92,22.86 30.61,26.54 30.61,27.56 33.15,30.1 33.15,30.83 32.61,31.37 v31.5,31.37 31.11,31.75 26.92,31.75 v26.67,31.5
MS3  (via drill 0.38)
  Top 0.254: IC1.P$11 25.91,33.4 27.56,31.75 28.32,31.75 v29.59,30.48 | IC2.P$11 42.42,33.27 40.01,30.86 36.7,30.86 32.64,30.86 v32.26,30.48 | IC3.31 16.31,19.68 15.24,19.68 14.99,19.94 12.32,19.94 v11.05,21.21
  Bottom 0.254: v32.26,30.48 v29.59,30.48 29.59,27.05 26.42,23.88 21.46,23.88 20.45,24.89 19.68,24.89 19.18,24.38 18.54,24.38 18.03,23.88 17.4,23.88 16.89,23.37 16.89,22.1 15.62,20.83 11.43,20.83 v11.05,21.21
N$1
  Bottom 0.406: 14.48,40.26 14.48,41.53
N$2
  Top 0.61: F1.1 44.83,18.42 44.89,18.35 | 44.89,18.35 47.5,15.75 48.13,15.75 48.26,15.88 D3.C | D2.C 39.49,17.02 40.64,17.02 42.42,17.02 43.56,18.16 44.7,18.16 44.83,18.29 44.89,18.35
N$3
  Top 0.254: C2.1 20.32,39.24 22.22,41.15 IC1.P$4
N$4
  Top 0.254: R13.2 R14.1 R18.1
N$5
  Top 0.254: IC1.P$5 22.49,40.65 21.21,39.37 21.21,35.56 20.95,35.31 20.41,35.31 C2.2
N$6
  Top 0.406: J7.VIN0 36.07,4.32
  Top 0.813: 36.07,4.32 38.61,6.86 38.61,10.67 38.61,12.57 41.02,14.99 41.04,14.97 D1.A
N$7
  Bottom 0.406: 41.17,15.24 D4.A
  Bottom 0.61: J6.VIN0 45.09,4.32 43.69,5.71 43.69,11.3 45.21,12.83 45.21,14.48 44.45,15.24 41.17,15.24
N$8
  Top 0.254: R24.1 R19.1 16.76,44.74 | IC5.1 16.76,44.7 16.76,44.74 | 16.76,44.74 16.76,45.12
N$9
  Top 0.254: R27.1 R23.1 55.12,20.19 54.86,19.93 IC4.1
N$10  (via drill 0.51)
  Top 0.61: v40.64,20.95 40.64,24.51 39.24,25.91 37.59,25.91 v37.34,26.16
  Bottom 0.254: 41.15,19.3 D4.C
  Bottom 0.61: 41.15,19.3 41.15,20.45 v40.64,20.95 | v37.34,26.16 37.21,26.29 37.21,42.04 32.89,46.36 30.35,46.36 27.81,48.9 19.56,48.9 17.02,46.36 JP12.1
N$11
  Top 0.254: IC1.P$7 U$9.P$1
N$12
  Top 0.254: IC1.P$20 28.9,42.15 U$11.P$1
N$13
  Top 0.254: IC1.P$25 U$10.P$1
N$14
  Top 0.254: IC2.P$7 U$6.P$1
N$15
  Top 0.254: IC2.P$20 U$7.P$1
N$16
  Top 0.254: IC2.P$4 38.61,41.15 36.07,38.61 C4.1
N$17
  Top 0.254: IC2.P$5 39,40.65 36.96,38.61 36.96,36.11 C4.2
N$18
  Top 0.254: IC2.P$25 U$8.P$1
N$19
  Top 0.254: IC1.P$13 26.91,37.86 27.81,36.96 28.41,36.96
  Top 0.305: 28.41,36.96 R8.1
N$20
  Top 0.254: IC1.P$8 24.41,37.58 C10.1
N$21
  Top 0.254: IC1.P$6 22.75,40.15 22.1,39.5 C5.1
N$26
  Top 0.254: LED2.C R16.2
N$27
  Top 0.254: R20.1 PWR.A
N$29
  Top 0.254: R26.1 29.2,3.05 USB.A
N$30
  Top 0.254: R25.1 23.89,3.05 USR.A
N$31
  Top 0.254: 24.91,48.21 24.78,48.21 24.78,48.3 R3.2
  Top 0.305: IC1.P$27 24.91,48.21
N$32
  Top 0.254: 26.91,48.08 26.91,48.18 R1.2
  Top 0.305: IC1.P$23 26.91,48.08
N$35
  Top 0.254: 33.55,45.71 LED1.C R15.2
N$36
  Top 0.61: 50.04,18.29 50.3,18.03 | 50.3,18.03 IC4.3 50.3,18.03 | 50.04,18.29 C15.2 | 50.04,18.29 50.3,18.03 | F1.2 48.77,19.56 50.04,18.29
N$41
  Top 0.254: IC2.P$6 39.26,40.15 38.35,39.24 C6.1
N$43
  Top 0.254: 43.42,48.08 43.42,48.18 R2.2
  Top 0.305: IC2.P$23 43.42,48.08
N$44
  Top 0.254: 41.42,48.08 41.42,48.18 R4.2
  Top 0.305: IC2.P$27 41.42,48.08
N$45
  Top 0.254: IC2.P$8 40.92,37.45 C9.1
N$48
  Top 0.254: IC2.P$13 43.42,37.61 44.07,36.96 44.92,36.96
  Top 0.305: 44.92,36.96 R7.1
PRG_SW
  Top 0.254: SW1.2 13.84,17.23 R21.1 16.89,16.47 16.89,16.89 17.53,17.53 17.53,20.19 17.22,20.5 IC3.30
RA1  (via drill 0.38)
  Top 0.254: 19.68,27.91 IC3.20 19.7,27.06 19.05,26.42 v17.91,26.42
  Bottom 0.254: v17.91,26.42 17.14,25.65 5.97,25.65 4.45,27.18 J4.8
RA2  (via drill 0.38)
  Top 0.254: IC3.21 18.9,28.73 18.41,29.21 16.64,29.21 16.13,28.7 16.13,27.56 v16.51,27.18
  Bottom 0.254: v16.51,27.18 15.49,26.16 7.24,26.16 4.95,28.45 3.05,28.45 J5.8
RA3  (via drill 0.38)
  Top 0.254: IC3.22 17.31,27.9 v17.02,28.19
  Bottom 0.254: v17.02,28.19 16.26,28.19 14.73,26.67 7.49,26.67 4.45,29.72 J4.9
RA5  (via drill 0.38)
  Top 0.254: IC3.24 17.42,25.3 17.42,25.25 v17.78,24.89
  Bottom 0.254: v17.78,24.89 17.53,25.15 5.71,25.15 4.95,25.91 3.05,25.91 J5.7
RB0  (via drill 0.38)
  Top 0.254: IC3.8 23.93,23.7 v22.99,24.64
  Bottom 0.254: JP2.3 11.56,49.66 11.56,36.58 15.37,32.77 18.29,32.77 22.73,28.32 24.89,28.32 26.29,26.92 26.29,25.15 25.53,24.38 23.24,24.38 v22.99,24.64
RB1  (via drill 0.51)
  Top 0.254: IC3.9 25.16,24.5 TP6.P$1
  Bottom 0.254: JP1.3 11.05,48.51 11.05,36.32 15.11,32.26 18.03,32.26 22.48,27.81 24.64,27.81 25.78,26.67 25.78,25.78 25.4,25.4 TP6.P$1
  other vias: 24.26,25.4
RB2  (via drill 0.38)
  Top 0.254: IC3.10 26.77,25.3 26.54,25.53 26.54,26.54 27.18,27.18 v27.18,27.43
  Bottom 0.254: v27.18,27.43 26.54,27.43 25.15,28.83 22.99,28.83 18.54,33.27 15.62,33.27 12.07,36.83 12.07,47.62 JP3.3
RB3  (via drill 0.38)
  Top 0.254: IC3.11 27.9,26.75 v28.57,27.43
  Bottom 0.254: v28.57,27.43 27.69,28.32 26.42,28.32 25.4,29.34 23.24,29.34 18.8,33.78 15.88,33.78 12.57,37.08 12.57,47.24 13.97,48.64 15.62,48.64 JP4.3
RB4  (via drill 0.38)
  Top 0.254: IC3.14 24.5,26.81 v24.77,26.54
  Bottom 0.254: JP5.3 6.86,46.99 9.27,44.58 9.27,37.34 14.86,31.75 17.78,31.75 22.22,27.3 24,27.3 v24.77,26.54
RB5  (via drill 0.38)
  Top 0.254: IC3.15 23.7,26.62 v23.62,26.54
  Bottom 0.254: JP6.3 6.86,44.45 8.76,42.55 8.76,37.08 14.61,31.24 17.53,31.24 21.97,26.8 23.37,26.8 v23.62,26.54
RB6  (via drill 0.38)
  Top 0.254: v24.38,17.78 21.46,20.7 21.46,24.38 22.35,25.27 v22.35,25.91 22.35,26.42 22.9,26.96 IC3.16
  Bottom 0.254: v24.38,17.78 24.89,17.27 27.18,17.27 27.94,18.03 32.51,18.03 36.96,22.48 40.89,22.48 44.2,25.78 52.07,25.78 52.58,26.29 52.58,27.18 53.34,27.94 53.34,32.64 53.72,33.02 53.72,34.67 J8.5 | v22.35,25.91 22.1,25.91 17.27,30.73 14.35,30.73 8.25,36.83 8.25,40.51 6.86,41.91 JP7.3
RB7  (via drill 0.38)
  Top 0.254: v23.11,17.78 20.95,19.94 20.95,25.27 v21.21,25.53 21.21,26.04 22.1,26.92 IC3.17
  Bottom 0.254: v23.11,17.78 24.13,16.76 27.43,16.76 28.19,17.53 32.77,17.53 37.21,21.97 41.15,21.97 44.32,25.15 52.2,25.15 53.09,26.04 53.09,26.92 53.85,27.69 53.85,32.26 J8.4 | v21.21,25.53 21.21,26.04 17.02,30.23 14.1,30.23 6.86,37.47 JP8.3
RC0  (via drill 0.38)
  Top 0.254: IC3.32 15.14,18.9 14.61,19.43 13.08,19.43 11.81,18.16 11.68,18.03 10.16,16.51 v9.65,16.51
  Bottom 0.254: v9.65,16.51 9.52,16.64 8.76,17.4 4.7,17.4 J4.4
RC2  (via drill 0.38)
  Top 0.254: IC3.36 19.7,17.67 v20.32,18.29 | v30.99,16.64 R14.2
  Bottom 0.254: J5.3 3.05,15.75 5.08,15.75 5.59,16.26 8.38,16.26 9.14,15.49 10.29,15.49 11.05,16.26 14.48,16.26 14.99,16.76 18.8,16.76 v20.32,18.29 20.7,18.67 21.72,18.67 22.22,18.16 22.22,17.02 22.99,16.26 27.69,16.26 28.19,16.76 30.86,16.76 v30.99,16.64
RC6  (via drill 0.38)
  Top 0.254: v26.92,14.73 26.67,14.73 26.1,15.3 IC3.44
  Bottom 0.254: v26.92,14.73 26.67,14.99 23.62,14.99 22.61,13.97 21.59,13.97 20.83,14.73 16.13,14.73 13.72,12.32 11.05,12.32 9.4,10.67 3.05,10.67 J5.1
RC7  (via drill 0.38)
  Top 0.254: 27.88,18.1 IC3.1 27.83,18.03 28.57,18.03 v28.57,15.88 | v11.94,14.86 11.94,14.1 | 11.94,14.1 10.71,14.1 R12.2 | 11.94,14.1 13.17,14.1 R17.1
  Bottom 0.254: v28.57,15.88 28.45,15.75 15.62,15.75 14.73,14.86 v11.94,14.86 10.29,13.21 3.05,13.21 J5.2
RD0  (via drill 0.38)
  Top 0.254: IC3.38 21.3,17.74 v21.34,17.78
  Bottom 0.254: v21.34,17.78 19.81,16.26 15.37,16.26 14.86,15.75 11.3,15.75 10.54,14.99 8.89,14.99 8.13,15.75 5.97,15.75 4.7,14.48 J4.3
RD1  (via drill 0.38)
  Top 0.254: v22.1,14.86 IC3.39
  Bottom 0.254: v22.1,14.86 21.72,15.24 15.88,15.24 13.46,12.83 10.8,12.83 9.91,11.94 J4.2
REF_RA0  (via drill 0.38)
  Top 0.254: IC2.P$17 44.83,40.64 47.42,40.64 v47.78,40.28 | v18.8,25.53 19.05,25.53 20.5,26.97 IC3.19 20.5,28.88 20.83,29.21 23.49,29.21 v24.51,30.23 | v27.81,30.86 29.08,29.59 29.84,29.59 30.73,28.7 31.5,28.7 31.88,29.08 33.02,29.08 33.78,29.84 34.8,29.84 | TP3.1 10.49,30.99 R11.2 | 34.8,29.84 40.39,29.84 v40.77,29.46 | 34.8,29.84 v34.8,28.32 | IC1.P$17 31.39,40.65 v31.72,40.31
  Bottom 0.254: v34.8,28.32 35.18,28.7 35.18,38.61 34.04,39.75 32.28,39.75 v31.72,40.31 | v40.77,29.46 44.83,29.46 46.86,31.5 46.86,38.99 47.78,39.9 v47.78,40.28 | v18.8,25.53 18.8,27.69 17.4,29.08 16.38,29.08 14.48,27.18 11.68,27.18 | 11.68,27.18 7.75,27.18 5.97,28.96 5.97,29.97 4.95,30.99 3.05,30.99 J5.9 | v24.51,30.23 27.18,30.23 v27.81,30.86 | TP3.1 10.41,30.99 11.81,29.59 11.81,27.3 11.68,27.18
SLEEP_1
  Top 0.254: R9.2 30.99,36.96 30.1,36.96 29.21,37.85 27.61,37.85 27.41,38.05 IC1.P$14
SLEEP_2
  Top 0.254: IC2.P$14 43.93,38.75 43.93,38.09 44.15,37.87 45.7,37.87 46.61,36.96 47.5,36.96 R10.2
STEP_1  (via drill 0.38)
  Top 0.254: v30.99,21.46 29.84,20.32 28.96,20.32 28.78,20.5 IC3.4 | IC1.P$16 30.69,40.15 v31.72,39.12
  Bottom 0.254: J5.6 3.05,23.37 4.95,23.37 8,20.32 15.88,20.32 17.65,22.1 18.92,22.1 19.3,21.72 27.3,21.72 27.69,22.1 30.23,22.1 30.86,21.46 v30.99,21.46 31.37,21.46 35.05,25.15 35.05,26.8 33.91,27.94 33.91,28.57 34.67,29.34 34.67,38.35 33.91,39.12 v31.72,39.12
STEP_2  (via drill 0.38)
  Top 0.254: IC3.2 26.64,18.9 v26.42,18.67 | IC2.P$16 46.29,40.15 47.52,38.91 v49.43,38.91
  Bottom 0.254: J5.4 3.05,18.29 17.91,18.29 19.3,19.68 22.35,19.68 22.86,19.18 25.02,19.18 25.53,18.67 v26.42,18.67 26.8,19.05 32,19.05 37.21,24.26 41.15,24.26 47.88,30.99 47.88,37.9 48.9,38.91 v49.43,38.91
USB_LED  (via drill 0.38)
  Top 0.254: IC3.41 23.7,13.39 24.51,12.57 25.02,12.57 v25.91,11.68 | R26.2 v33.15,3.05
  Bottom 0.254: v25.91,11.68 30.86,11.68 32.26,10.29 32.26,3.94 v33.15,3.05
USR_LED  (via drill 0.38)
  Top 0.254: IC3.40 22.9,13.42 v24.64,11.68 | v21.21,4.32 21.21,3.09 R25.2
  Bottom 0.254: v24.64,11.68 21.21,8.25 v21.21,4.32
V+  (via drill 0.38, 0.51)
  Top 0.254: v38.35,33.53 C6.2 | 24.41,44.96 C7.1 | 27.41,44.96 C8.1 | 41.15,19.43 D1.C 41.4,18.82 | C5.2 22.1,35.18 20.83,33.91 v19.81,33.91 | IC5.3 12.19,44.07 11.3,44.96 C21.2
  Top 0.305: IC1.P$28 24.41,44.96 24.41,45.7 v23.88,46.23 | IC1.P$22 27.41,44.96 27.41,45.7 v27.94,46.23 | 40.92,44.96 40.92,45.7 v40.39,46.23 | 40.92,44.96 IC2.P$28 | 40.92,44.96 C11.1 | 43.92,44.96 43.92,45.57 v44.58,46.23 | 43.92,44.96 IC2.P$22 | 43.92,44.96 C12.1
  Top 0.406: v30.61,47.5 30.1,47.5 28.83,46.23 v27.94,46.23 | v40.39,46.23 39.5,46.23 38.23,47.5 v37.59,47.5
  Top 0.61: IC5.3 13.44,42.14 v13.84,42.55 | R13.1 33.49,15.33 D2.A 35.18,15.75 38.1,18.67 38.23,18.8 38.5,19.07 D1.C
  Top 0.813: 41.15,19.43 42.42,20.7 42.42,26.05 41.28,27.18 | 38.1,28.45 C14.+ 40.02,28.45 41.28,27.18 | 41.28,27.18 v41.15,27.3
  Bottom 0.254: v19.81,33.91 19.43,33.91 19.05,34.29 16.13,34.29 13.08,37.34 13.08,41.78 v13.84,42.55 | 38.23,33.53 v38.35,33.53
  Bottom 0.406: v27.94,46.23 v23.88,46.23 | v40.39,46.23 v44.58,46.23
  Bottom 0.61: v37.59,47.5 34.54,47.5 v30.61,47.5 28.32,49.78 19.18,49.78 13.84,44.45 v13.84,42.55
  Bottom 0.813: 34.54,47.5 34.54,46.1 38.23,42.42 38.23,33.53 38.23,30.23 v41.15,27.3
VBUS  (via drill 0.38, 0.51)
  Top 0.254: J3.VBUS 12.88,8.18 | R12.1 10.67,10.41 12.01,9.07 12.88,9.07 12.88,8.18 | 12.88,8.18 12.83,8.13
  Top 0.406: 12.83,8.13 v11.81,8.13 | D3.A 44.07,15.62 44.07,14.86 v41.78,12.57
  Bottom 0.406: v11.81,8.13 19.56,8.13 24,12.57 30.35,12.57 v41.78,12.57
VCAP
  Top 0.254: IC3.23 13.53,26.1 C13.A

### Text on the board
Top: schmalzhaus.com/EBB | EiBot | Board
Bottom: 1/5/12
tPlace: GND | 5V | GND | 5V | B1 | B0 | B2 | B3 | GND | B4 | MOTOR1 | MOTOR2 | B5 | B6 | DIR1 | DIR2 | B7 | 3.3V | GND | 3.3V | 3.3V | 5V | + | schmalzhaus.com/EBB | CUR | A0 | A3 | ADJ | ICSP | A2 | A1 | A5 | E0 | D6 | D7 | RST | C1 | D5 | D4 | C0 | PRG | C2 | D0 | C7 | D1 | C6 | EiBot | J5 | J4 | GND | PWR | Board | IN | GND | USR | USB | 9-30VDC
bPlace: GND | 5V | GND | 5V | B1 | B0 | B2 | B3 | B5 | B4 | GND | Arm | Pen | MOTOR 1 | MOTOR 2 | B6 | Servos | 3.3V | B7 | GND | GND | JP12 | 3.3V | 3.3V | JP13 | EiBotBoard | PGC(RB6) | 5V | 5V | PGD(RB7) | A0 | A3 | Released under Creative | ICSP | GND | Commons V3.0 Attribution | A2 | A1 | Licence by SchmalzHaus | 3.3V | A5 | E0 | MCLR | D6 | D7 | C1 | D5 | D4 | C0 | C2 | D0 | 4-6V DC | C7 | D1 | C6 | GND | IO PINS | J5 | J4 | for more information see: | www.schmalzhaus.com/EBB